# Altium schematic sheet Step Moter Control.SchDoc
size A4
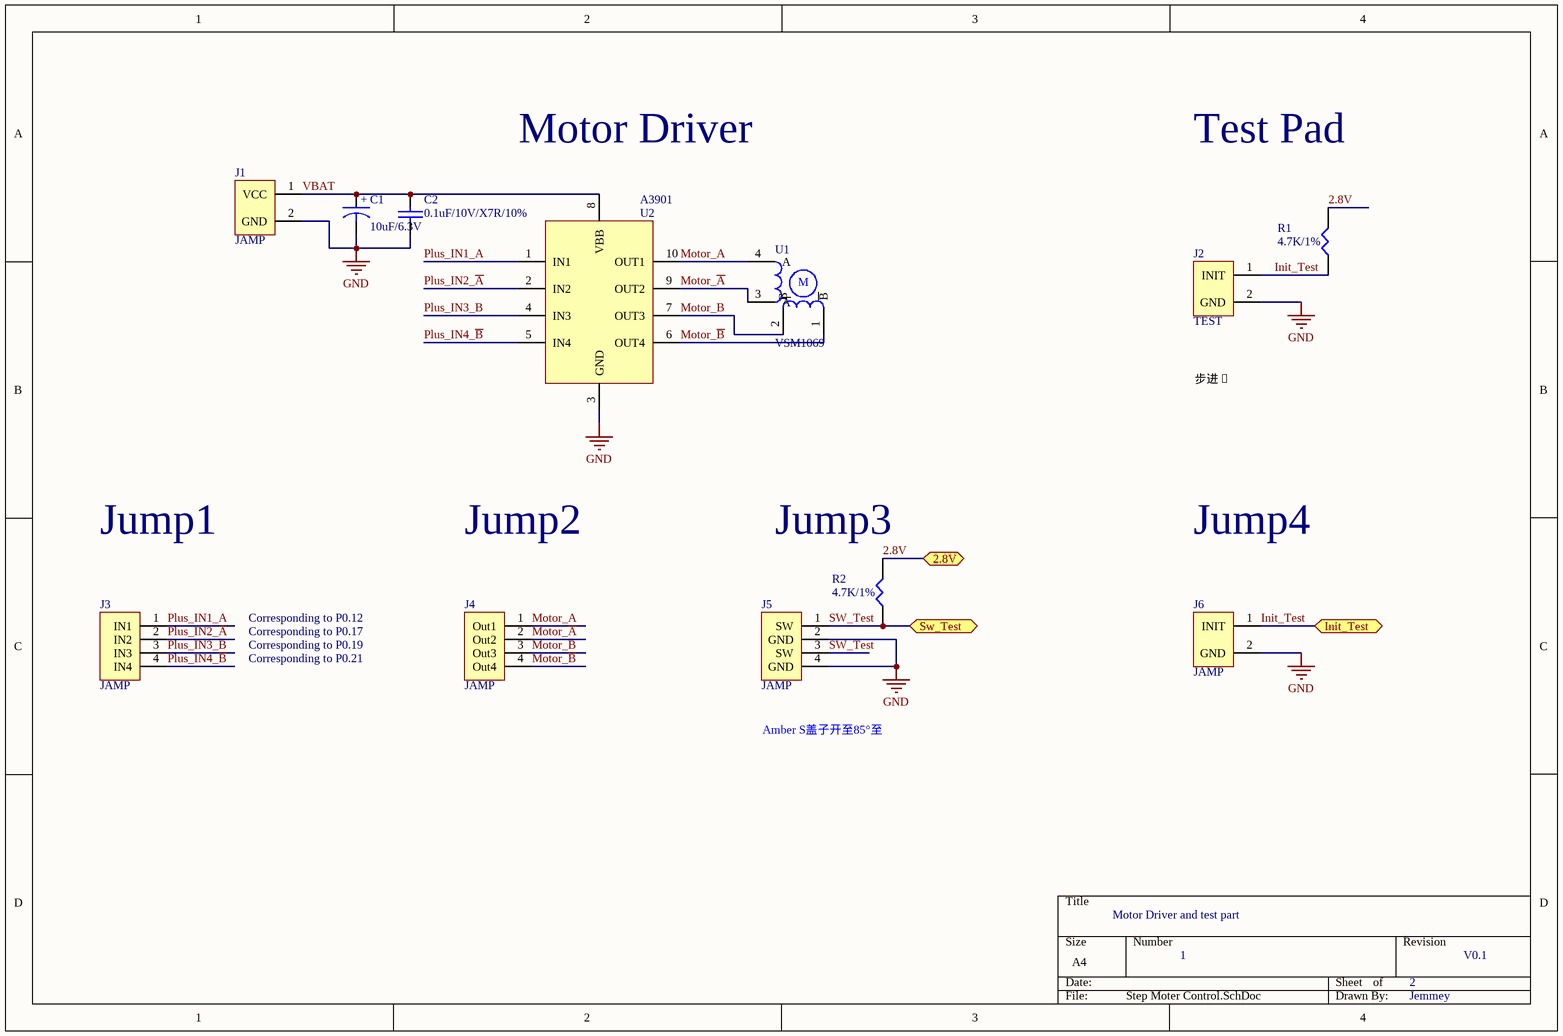
[diagram p0: Step Moter Control.SchDoc]

## Parts
C1  10uF/6.3V  [3216]
C2  0.1uF/10V/X7R/10%  [0402C]
J1  JAMP  [Debug- 1.27*2]
J2  TEST  [Debug- 1.27*2]
J3  JAMP  [Debug- 1.27*4]
J4  JAMP  [Debug- 1.27*4]
J5  JAMP  [Debug- 1.27*4]
J6  JAMP  [Debug- 1.27*2]
R1  4.7K/1%  [0402R]
R2  4.7K/1%  [0402R]
U1  VSM1069  [FPC_CON5-6200]
U2  A3901  [DFN10]

## Ports
2.8V, Init_Test, Sw_Test

## Nets
GND: C1.2 C2.2 J1.2(GND) J2.2(GND) J5.2(GND) J5.4(GND) J6.2(GND) U2.3(GND)
2.8V: R1.2 R2.2 ; port 2.8V
Init_Test: J2.1(INIT) J6.1(INIT) R1.1 ; port Init_Test
Motor_A: J4.1(Out1) U1.4(A) U2.10(OUT1)
Motor_~{A}: J4.2(Out2) U1.3(~{A}) U2.9(OUT2)
Motor_B: J4.3(Out3) U1.2(B) U2.7(OUT3)
Motor_~{B}: J4.4(Out4) U1.1(~{B}) U2.6(OUT4)
Plus_IN1_A: J3.1(IN1) U2.1(IN1)
Plus_IN2_~{A}: J3.2(IN2) U2.2(IN2)
Plus_IN3_B: J3.3(IN3) U2.4(IN3)
Plus_IN4_~{B}: J3.4(IN4) U2.5(IN4)
SW_Test: J5.1(SW) J5.3(SW) R2.1 ; port Sw_Test
VBAT: C1.1 C2.1 J1.1(VCC) U2.8(VBB)

## Notes on the sheet
- Motor Driver
- Test Pad
- 步进�
- Jump1
- Jump2
- (near R2) Jump3
- Jump4
- Corresponding to P0.19
- Corresponding to P0.17
- Corresponding to P0.12
- Corresponding to P0.21
- Amber S盖子开至85°至
- Motor Driver and test part
- 1
- 2
- V0.1
- Jemmey
- (in symbol Cap) +
- (in symbol VSM1069) M

## Library data of the parts
C1 = Cap: 厂家：ROHM，型号：
C2 = CAP: 厂家：Murata，型号：GRM155R71A104KA01D
J1 J3-J6 = JAMP: 厂家：暂定，型号：暂定
J2 = TEST: 厂家：暂定，型号：暂定
R1 R2 = RES1: 厂家：Yageo，型号：RC0402FR-074K7L
U1 = VSM1069: 厂家：常州唯可泰，型号：VSM1069；二相步进电机
U2 = A3901: 厂家：Allegro ，型号：A3901 Two phase stepper motor drives